# Altium schematic sheet 09. SOC CSI & DSI IF.SchDoc: CSI & DSI INTERFACE
size 513 x 386 mm; Project: PROC154E2(001)_SK_AM69; Issue: 1.0; RevCode: E3; Page Create Date: March  8, 1995; Variant Name: Core Design; Schematic Page Number: 9; Page Number: 9; Page Size: C; Comment: MISTRAL_TITLEBLK_CSIZE_1; Page Count: 62; Schematic Page Count: 62; Name: PROC154E2 001 SK AM69; DsnPath: C:\Users\danie\Downloads\sprr466c\PROC154E3_RP\PROC154E3_SCH.DSN; SchematicName: SCHEMATIC1; PageName: 09. SOC CSI & DSI IF; PageSize: C; TopSchematic: True
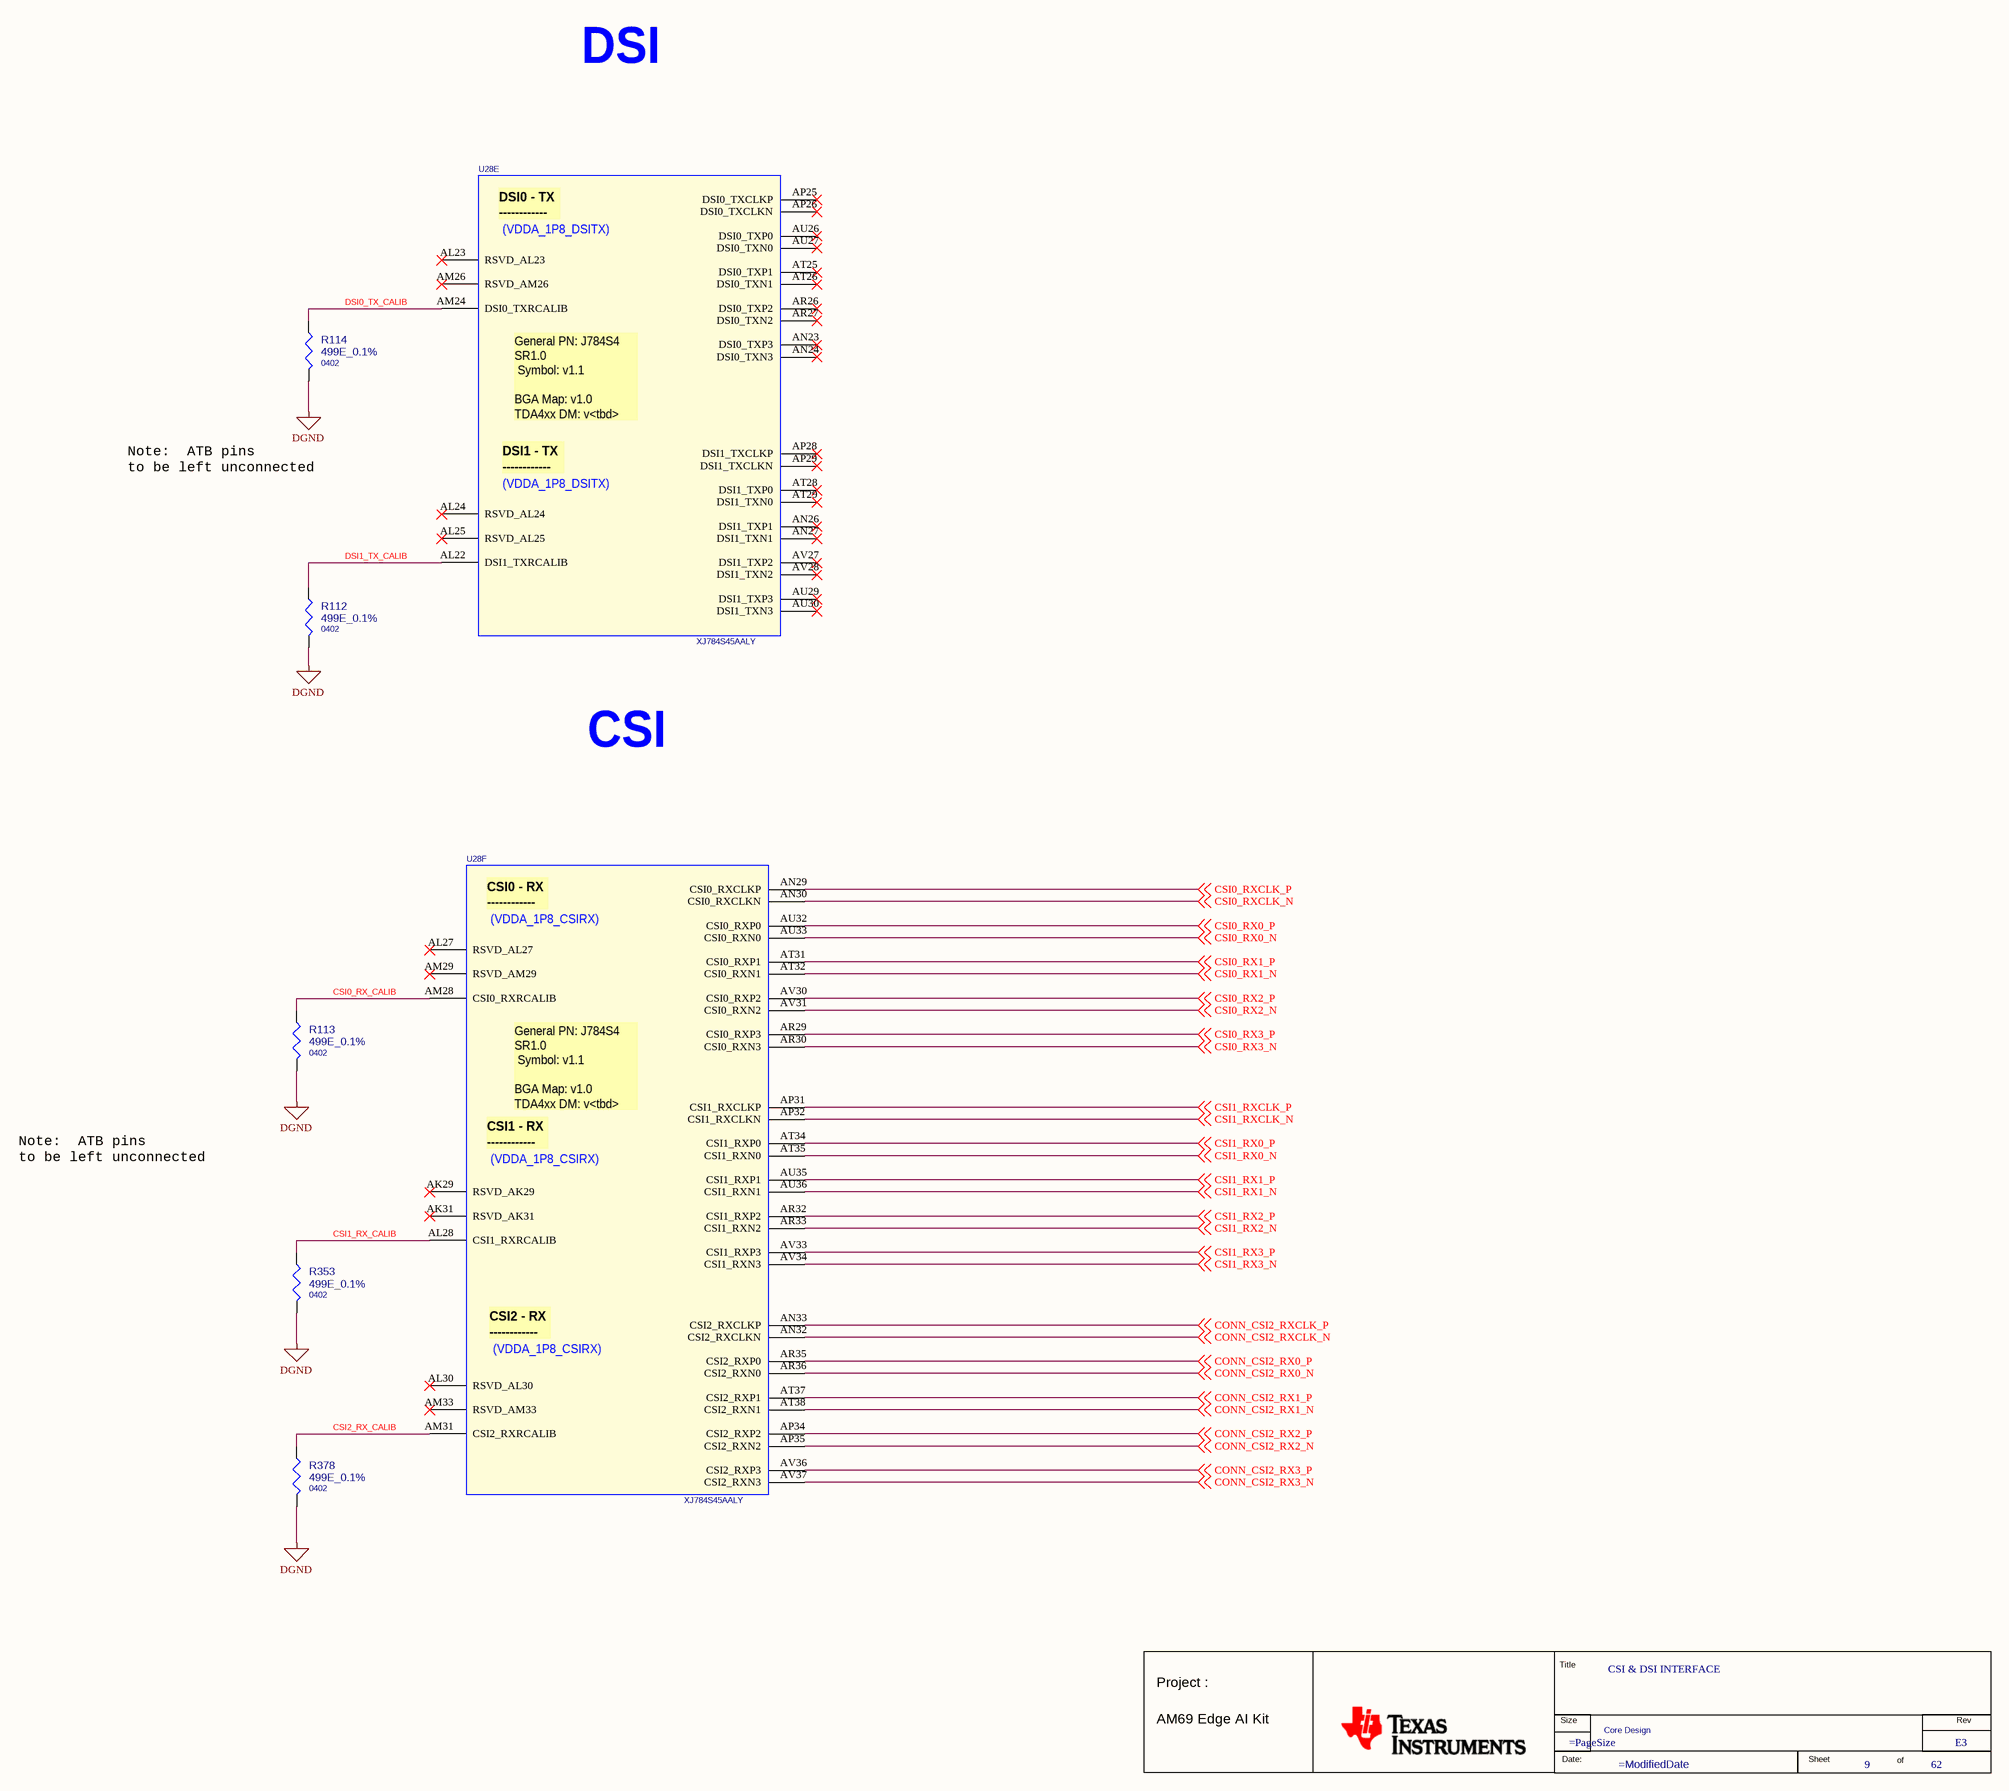
[diagram p0: 09. SOC CSI & DSI IF.SchDoc]

## Parts
*  RevCode: E3  Title: CSI & DSI INTERFACE  Page Number: 9  Page Count: 62  Variant Name: Core Design  (hidden comment: MISTRAL_TITLEBLK_CSIZE_1)  (graphical)
R112  499E_0.1%  Package: 0402  [RES0402_0-5]
R113  499E_0.1%  Package: 0402  [RES0402_0-5]
R114  499E_0.1%  Package: 0402  [RES0402_0-5]
R353  499E_0.1%  Package: 0402  [RES0402_0-5]
R378  499E_0.1%  Package: 0402  [RES0402_0-5]
U28  XJ784S45AALY  [BGA1414_31-49_1230X1230_2-7]  (parts E,F of 26)

## Nets
DGND: R112.2 R113.2 R114.2 R353.2 R378.2
CONN_CSI2_RX0_N: U28.AR36(CSI2_RXN0) ; off-sheet CONN_CSI2_RX0_N
CONN_CSI2_RX0_P: U28.AR35(CSI2_RXP0) ; off-sheet CONN_CSI2_RX0_P
CONN_CSI2_RX1_N: U28.AT38(CSI2_RXN1) ; off-sheet CONN_CSI2_RX1_N
CONN_CSI2_RX1_P: U28.AT37(CSI2_RXP1) ; off-sheet CONN_CSI2_RX1_P
CONN_CSI2_RX2_N: U28.AP35(CSI2_RXN2) ; off-sheet CONN_CSI2_RX2_N
CONN_CSI2_RX2_P: U28.AP34(CSI2_RXP2) ; off-sheet CONN_CSI2_RX2_P
CONN_CSI2_RX3_N: U28.AV37(CSI2_RXN3) ; off-sheet CONN_CSI2_RX3_N
CONN_CSI2_RX3_P: U28.AV36(CSI2_RXP3) ; off-sheet CONN_CSI2_RX3_P
CONN_CSI2_RXCLK_N: U28.AN32(CSI2_RXCLKN) ; off-sheet CONN_CSI2_RXCLK_N
CONN_CSI2_RXCLK_P: U28.AN33(CSI2_RXCLKP) ; off-sheet CONN_CSI2_RXCLK_P
CSI0_RX0_N: U28.AU33(CSI0_RXN0) ; off-sheet CSI0_RX0_N
CSI0_RX0_P: U28.AU32(CSI0_RXP0) ; off-sheet CSI0_RX0_P
CSI0_RX1_N: U28.AT32(CSI0_RXN1) ; off-sheet CSI0_RX1_N
CSI0_RX1_P: U28.AT31(CSI0_RXP1) ; off-sheet CSI0_RX1_P
CSI0_RX2_N: U28.AV31(CSI0_RXN2) ; off-sheet CSI0_RX2_N
CSI0_RX2_P: U28.AV30(CSI0_RXP2) ; off-sheet CSI0_RX2_P
CSI0_RX3_N: U28.AR30(CSI0_RXN3) ; off-sheet CSI0_RX3_N
CSI0_RX3_P: U28.AR29(CSI0_RXP3) ; off-sheet CSI0_RX3_P
CSI0_RX_CALIB: R113.1 U28.AM28(CSI0_RXRCALIB)
CSI0_RXCLK_N: U28.AN30(CSI0_RXCLKN) ; off-sheet CSI0_RXCLK_N
CSI0_RXCLK_P: U28.AN29(CSI0_RXCLKP) ; off-sheet CSI0_RXCLK_P
CSI1_RX0_N: U28.AT35(CSI1_RXN0) ; off-sheet CSI1_RX0_N
CSI1_RX0_P: U28.AT34(CSI1_RXP0) ; off-sheet CSI1_RX0_P
CSI1_RX1_N: U28.AU36(CSI1_RXN1) ; off-sheet CSI1_RX1_N
CSI1_RX1_P: U28.AU35(CSI1_RXP1) ; off-sheet CSI1_RX1_P
CSI1_RX2_N: U28.AR33(CSI1_RXN2) ; off-sheet CSI1_RX2_N
CSI1_RX2_P: U28.AR32(CSI1_RXP2) ; off-sheet CSI1_RX2_P
CSI1_RX3_N: U28.AV34(CSI1_RXN3) ; off-sheet CSI1_RX3_N
CSI1_RX3_P: U28.AV33(CSI1_RXP3) ; off-sheet CSI1_RX3_P
CSI1_RX_CALIB: R353.1 U28.AL28(CSI1_RXRCALIB)
CSI1_RXCLK_N: U28.AP32(CSI1_RXCLKN) ; off-sheet CSI1_RXCLK_N
CSI1_RXCLK_P: U28.AP31(CSI1_RXCLKP) ; off-sheet CSI1_RXCLK_P
CSI2_RX_CALIB: R378.1 U28.AM31(CSI2_RXRCALIB)
DSI0_TX_CALIB: R114.1 U28.AM24(DSI0_TXRCALIB)
DSI1_TX_CALIB: R112.1 U28.AL22(DSI1_TXRCALIB)

Not connected (* = marked no-connect by the designer): U28 AK29(RSVD_AK29)* AK31(RSVD_AK31)* AL23(RSVD_AL23)* AL24(RSVD_AL24)* AL25(RSVD_AL25)* AL27(RSVD_AL27)* AL30(RSVD_AL30)* AM26(RSVD_AM26)* AM29(RSVD_AM29)* AM33(RSVD_AM33)* AN23(DSI0_TXP3)* AN24(DSI0_TXN3)* AN26(DSI1_TXP1)* AN27(DSI1_TXN1)* AP25(DSI0_TXCLKP)* AP26(DSI0_TXCLKN)* AP28(DSI1_TXCLKP)* AP29(DSI1_TXCLKN)* AR26(DSI0_TXP2)* AR27(DSI0_TXN2)* AT25(DSI0_TXP1)* AT26(DSI0_TXN1)* AT28(DSI1_TXP0)* AT29(DSI1_TXN0)* AU26(DSI0_TXP0)* AU27(DSI0_TXN0)* AU29(DSI1_TXP3)* AU30(DSI1_TXN3)* AV27(DSI1_TXP2)* AV28(DSI1_TXN2)*

## Notes on the sheet
- DSI
- Note:  ATB pins
  to be left unconnected
- CSI
- (in symbol J7AHPSoC-EVM_BGA1414, part E) DSI0 - TX / ------------; (VDDA_1P8_DSITX); General PN: J784S4 / SR1.0 / Symbol: v1.1 / BGA Map: v1.0 / TDA4xx DM: v<tbd>; DSI1 - TX / ------------
- (in symbol J7AHPSoC-EVM_BGA1414, part F) CSI0 - RX / ------------; (VDDA_1P8_CSIRX); General PN: J784S4 / SR1.0 / Symbol: v1.1 / BGA Map: v1.0 / TDA4xx DM: v<tbd>; CSI1 - RX / ------------; CSI2 - RX / ------------
- (in symbol MISTRAL_TITLEBLK_CSIZE_1) Title; Project :; Size; Rev; AM69 Edge AI Kit; Date:; Sheet; of

## Library data of the parts
* = MISTRAL_TITLEBLK_CSIZE_1: Issue: 1.0; Project: PROC154E2(001)_SK_AM69; Name: PROC154E2 001 SK AM69; Page Create Date: March  8, 1995; Page Size: =PageSize; Page Modify Date: =ModifiedDate; Schematic Page Count: 62; Schematic Page Number: 9
R112 = RESISTOR_Dup2: RES 499E 1/16W 0.1% 0402; Part Reference: R112; Mfr_name: YAGEO AMERICA; Part_type: RESISTORS\FIXED; Mfr_part_number: RT0402BRD07499RL; Mistral Part No: 110021020006-R; Custom_Duty: 15%; Customs_HS_Code: 85332119; Voltage: NA; Project: TI_AM62x SKEVM_BRD; Value: 499E_0.1%; PCB Footprint: RES0402_0-5; Footprint Path: Y:\MIS_DATABASE\Library\ALTIUM_TOOL\PCB_FOOTPRINTS\Altium_Footprint_Lib.PcbLib; Library Path: Y:\MIS_DATABASE\Library\ALTIUM_TOOL\SCHEMATICS_PARTS\MS_DISCRETE_Library.schlib; MECHANICAL 3D STEP FILE: RES0402_0-5; Chkd/date: ALVY/200921; Crtd /date: MANIRAJA/200921; Datasheet: Y:\MIS_DATABASE\DATASHEETS\RESISTORS\YAGEO_RT-SERIES.PDF; Temperature: -55°C+155°C; Weight: 0.65mg; Height: 0.35MM; Library Ref: RESISTOR; Distributor_part_number: YAG1440CT-ND; Distributor_name: DIGIKEY; Wattage: 1/16W; Tolerance: 0.1%; Manufacturer: YAGEO AMERICA; Footprint Ref: RES0402_0-5
R113 = RESISTOR_Dup2: RES 499E 1/16W 0.1% 0402; Part Reference: R113; Mfr_name: YAGEO AMERICA; Mistral Part No: 110021020006-R; Mfr_part_number: RT0402BRD07499RL; Part_type: RESISTORS\FIXED; Project: TI_AM62x SKEVM_BRD; Voltage: NA; Customs_HS_Code: 85332119; Custom_Duty: 15%; Value: 499E_0.1%; PCB Footprint: RES0402_0-5; Footprint Ref: RES0402_0-5; Manufacturer: YAGEO AMERICA; Tolerance: 0.1%; Wattage: 1/16W; Distributor_name: DIGIKEY; Distributor_part_number: YAG1440CT-ND; Library Ref: RESISTOR; Height: 0.35MM; Weight: 0.65mg; Temperature: -55°C+155°C; Datasheet: Y:\MIS_DATABASE\DATASHEETS\RESISTORS\YAGEO_RT-SERIES.PDF; Crtd /date: MANIRAJA/200921; Chkd/date: ALVY/200921; MECHANICAL 3D STEP FILE: RES0402_0-5; Library Path: Y:\MIS_DATABASE\Library\ALTIUM_TOOL\SCHEMATICS_PARTS\MS_DISCRETE_Library.schlib; Footprint Path: Y:\MIS_DATABASE\Library\ALTIUM_TOOL\PCB_FOOTPRINTS\Altium_Footprint_Lib.PcbLib
R114 = RESISTOR_Dup2: RES 499E 1/16W 0.1% 0402; Part Reference: R114; Mfr_name: YAGEO AMERICA; Mistral Part No: 110021020006-R; Mfr_part_number: RT0402BRD07499RL; Part_type: RESISTORS\FIXED; Project: TI_AM62x SKEVM_BRD; Voltage: NA; Customs_HS_Code: 85332119; Custom_Duty: 15%; Value: 499E_0.1%; PCB Footprint: RES0402_0-5; Footprint Ref: RES0402_0-5; Manufacturer: YAGEO AMERICA; Tolerance: 0.1%; Wattage: 1/16W; Distributor_name: DIGIKEY; Distributor_part_number: YAG1440CT-ND; Library Ref: RESISTOR; Height: 0.35MM; Weight: 0.65mg; Temperature: -55°C+155°C; Datasheet: Y:\MIS_DATABASE\DATASHEETS\RESISTORS\YAGEO_RT-SERIES.PDF; Crtd /date: MANIRAJA/200921; Chkd/date: ALVY/200921; MECHANICAL 3D STEP FILE: RES0402_0-5; Library Path: Y:\MIS_DATABASE\Library\ALTIUM_TOOL\SCHEMATICS_PARTS\MS_DISCRETE_Library.schlib; Footprint Path: Y:\MIS_DATABASE\Library\ALTIUM_TOOL\PCB_FOOTPRINTS\Altium_Footprint_Lib.PcbLib
R353 = RESISTOR_Dup2: RES 499E 1/16W 0.1% 0402; Part Reference: R353; Mfr_name: YAGEO AMERICA; Part_type: RESISTORS\FIXED; Mfr_part_number: RT0402BRD07499RL; Mistral Part No: 110021020006-R; Custom_Duty: 15%; Customs_HS_Code: 85332119; Voltage: NA; Project: TI_AM62x SKEVM_BRD; Value: 499E_0.1%; PCB Footprint: RES0402_0-5; Footprint Path: Y:\MIS_DATABASE\Library\ALTIUM_TOOL\PCB_FOOTPRINTS\Altium_Footprint_Lib.PcbLib; Library Path: Y:\MIS_DATABASE\Library\ALTIUM_TOOL\SCHEMATICS_PARTS\MS_DISCRETE_Library.schlib; MECHANICAL 3D STEP FILE: RES0402_0-5; Chkd/date: ALVY/200921; Crtd /date: MANIRAJA/200921; Datasheet: Y:\MIS_DATABASE\DATASHEETS\RESISTORS\YAGEO_RT-SERIES.PDF; Temperature: -55°C+155°C; Weight: 0.65mg; Height: 0.35MM; Library Ref: RESISTOR; Distributor_part_number: YAG1440CT-ND; Distributor_name: DIGIKEY; Wattage: 1/16W; Tolerance: 0.1%; Manufacturer: YAGEO AMERICA; Footprint Ref: RES0402_0-5
R378 = RESISTOR_Dup2: RES 499E 1/16W 0.1% 0402; Part Reference: R378; Mfr_name: YAGEO AMERICA; Part_type: RESISTORS\FIXED; Mfr_part_number: RT0402BRD07499RL; Mistral Part No: 110021020006-R; Custom_Duty: 15%; Customs_HS_Code: 85332119; Voltage: NA; Project: TI_AM62x SKEVM_BRD; Value: 499E_0.1%; PCB Footprint: RES0402_0-5; Footprint Path: Y:\MIS_DATABASE\Library\ALTIUM_TOOL\PCB_FOOTPRINTS\Altium_Footprint_Lib.PcbLib; Library Path: Y:\MIS_DATABASE\Library\ALTIUM_TOOL\SCHEMATICS_PARTS\MS_DISCRETE_Library.schlib; MECHANICAL 3D STEP FILE: RES0402_0-5; Chkd/date: ALVY/200921; Crtd /date: MANIRAJA/200921; Datasheet: Y:\MIS_DATABASE\DATASHEETS\RESISTORS\YAGEO_RT-SERIES.PDF; Temperature: -55°C+155°C; Weight: 0.65mg; Height: 0.35MM; Library Ref: RESISTOR; Distributor_part_number: YAG1440CT-ND; Distributor_name: DIGIKEY; Wattage: 1/16W; Tolerance: 0.1%; Manufacturer: YAGEO AMERICA; Footprint Ref: RES0402_0-5
U28 = J7AHPSoC-EVM_BGA1414: IC AM69 SoC EVM MICROPROCESSOR BGA1414; Part Reference: U28; Manufacturer: TEXAS INSTRUMENTS; Mistral Part No: 141230020002; Part_type: ICS\DIGITAL\MICROPROCESSOR; SPLIT_INST: TRUE; SWAP_INFO: (S1+S2+S3+S4+S5+S6+S7+S8+S9+S10+S11+S12+S13+S14+S15+S16+S17+S18+S19+S20+S21+S22+S23+S24+S25+S26); Project: TI_J7AHP SK_BRD; Tolerance: NA; Customs_HS_Code: 85423100; Custom_Duty: 15%; Value: XJ784S45AALY; Footprint Ref: BGA1414_31-49_1230X1230_2-7; Mfr_name: TEXAS INSTRUMENTS; Mfr_part_number: XJ784S45AALY; Voltage: NA; Wattage: NA; Package: BGA1414; Distributor_name: NA; Distributor_part_number: NA; Library Ref: J7AHPSoC-EVM_BGA1414; Height: 2.70MM; Weight: NA; Temperature: NA; Datasheet: Y:\MIS_DATABASE\DATASHEETS\ICS\DIGITAL\MICROCONTROLLER\J7AHP-SoC-EVM.PDF; Crtd /date: ALVY/141221; Chkd/date: MANIRAJA/151221; RoHS: NA; MECHANICAL 3D STEP FILE: BGA1414_31-49_1230X1230_2-7; Library Path: Y:\MIS_DATABASE\Library\ALTIUM_TOOL\SCHEMATICS_PARTS\MS_MICROPROCESSOR_Library.schlib; Footprint Path: Y:\MIS_DATABASE\Library\ALTIUM_TOOL\PCB_FOOTPRINTS\Altium_Footprint_Lib.PcbLib; PCB Footprint: BGA1414_31-49_1230X1230_2-7